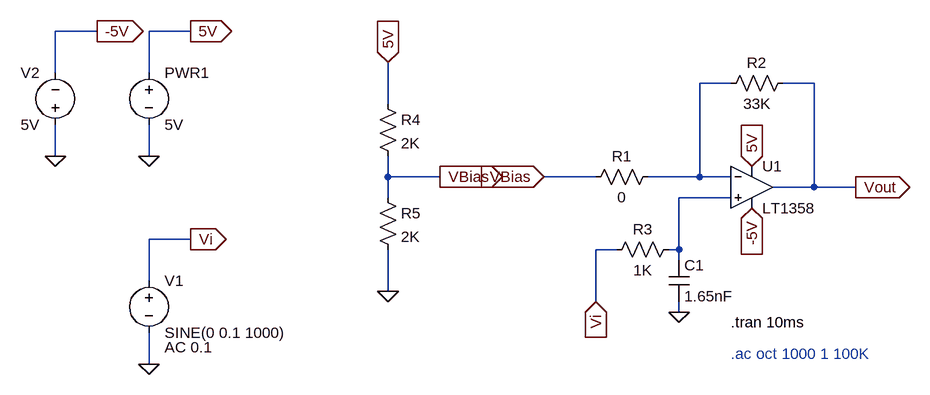
[diagram p0: schematic nobias.asc]
nobias.asc, the LTspice schematic file:
Version 4
SHEET 1 1300 680
WIRE 32 -16 -32 -16
WIRE 176 -16 112 -16
WIRE -32 48 -32 -16
WIRE 112 48 112 -16
WIRE 1008 64 960 64
WIRE 1136 64 1088 64
WIRE 480 96 480 32
WIRE -32 176 -32 128
WIRE 112 176 112 128
WIRE 480 208 480 176
WIRE 560 208 480 208
WIRE 800 208 720 208
WIRE 960 208 960 64
WIRE 960 208 880 208
WIRE 1008 208 960 208
WIRE 1136 224 1136 64
WIRE 1136 224 1072 224
WIRE 1200 224 1136 224
WIRE 480 240 480 208
WIRE 1008 240 928 240
WIRE 176 304 112 304
WIRE 832 320 800 320
WIRE 928 320 928 240
WIRE 928 320 912 320
WIRE 928 336 928 320
WIRE 112 368 112 304
WIRE 480 384 480 320
WIRE 800 400 800 320
WIRE 928 416 928 400
WIRE 112 496 112 448
FLAG 112 176 0
FLAG 176 -16 5V
IOPIN 176 -16 Out
FLAG 112 496 0
FLAG 176 304 Vi
IOPIN 176 304 Out
FLAG 32 -16 -5V
IOPIN 32 -16 Out
FLAG -32 176 0
FLAG 1040 192 5V
IOPIN 1040 192 In
FLAG 1040 256 -5V
IOPIN 1040 256 In
FLAG 1200 224 Vout
IOPIN 1200 224 Out
FLAG 800 400 Vi
IOPIN 800 400 In
FLAG 928 416 0
FLAG 480 384 0
FLAG 480 32 5V
IOPIN 480 32 In
FLAG 560 208 VBias
IOPIN 560 208 Out
FLAG 720 208 VBias
IOPIN 720 208 In
SYMBOL Voltage 112 32 R0
SYMATTR InstName PWR1
SYMATTR Value 5V
SYMBOL Voltage 112 352 R0
WINDOW 123 24 118 Left 2
SYMATTR InstName V1
SYMATTR Value SINE(0 0.1 1000)
SYMATTR Value2 AC 0.1
SYMBOL Voltage -32 144 R180
WINDOW 0 24 96 Left 2
WINDOW 3 24 16 Left 2
SYMATTR InstName V2
SYMATTR Value 5V
SYMBOL Res 896 192 R90
WINDOW 0 0 56 VBottom 2
WINDOW 3 32 56 VTop 2
SYMATTR InstName R1
SYMATTR Value 0
SYMBOL Res 1104 48 R90
WINDOW 0 0 56 VBottom 2
WINDOW 3 32 56 VTop 2
SYMATTR InstName R2
SYMATTR Value 33K
SYMBOL Cap 912 336 R0
SYMATTR InstName C1
SYMATTR Value 1.65nF
SYMBOL Res 928 304 R90
WINDOW 0 0 56 VBottom 2
WINDOW 3 32 56 VTop 2
SYMATTR InstName R3
SYMATTR Value 1K
SYMBOL OpAmps/LT1358 1040 160 R0
SYMATTR InstName U1
SYMBOL Res 464 80 R0
SYMATTR InstName R4
SYMATTR Value 2K
SYMBOL Res 464 224 R0
SYMATTR InstName R5
SYMATTR Value 2K
TEXT 1008 432 Left 2 !.tran 10ms
TEXT 1008 480 Left 2 ;.ac oct 1000 1 100K

The netlist it stands for:
* nobias.asc
V§PWR1 5V 0 5V
V1 Vi 0 SINE(0 0.1 1000) AC 0.1
V2 0 -5V 5V
R1 N001 VBias 0
R2 Vout N001 33K
C1 N002 0 1.65nF
R3 N002 Vi 1K
XU1 N002 N001 5V -5V Vout LT1357  ; LT1358, pins In+ In- V+ V- OUT
R4 5V VBias 2K
R5 VBias 0 2K
.tran 10ms
* .ac oct 1000 1 100K
.lib LTC.lib
.backanno
.end